# Altium schematic sheet Sheet1.SchDoc: Controle de Motor
size A4; Organization: Altium Limited; Address1: L3, 12a Rodborough Rd; Address2: Frenchs Forest; Address3: NSW; Address4: Australia 2086; DocumentNumber: 001; Revision: 0; SheetNumber: 1; SheetTotal: 2
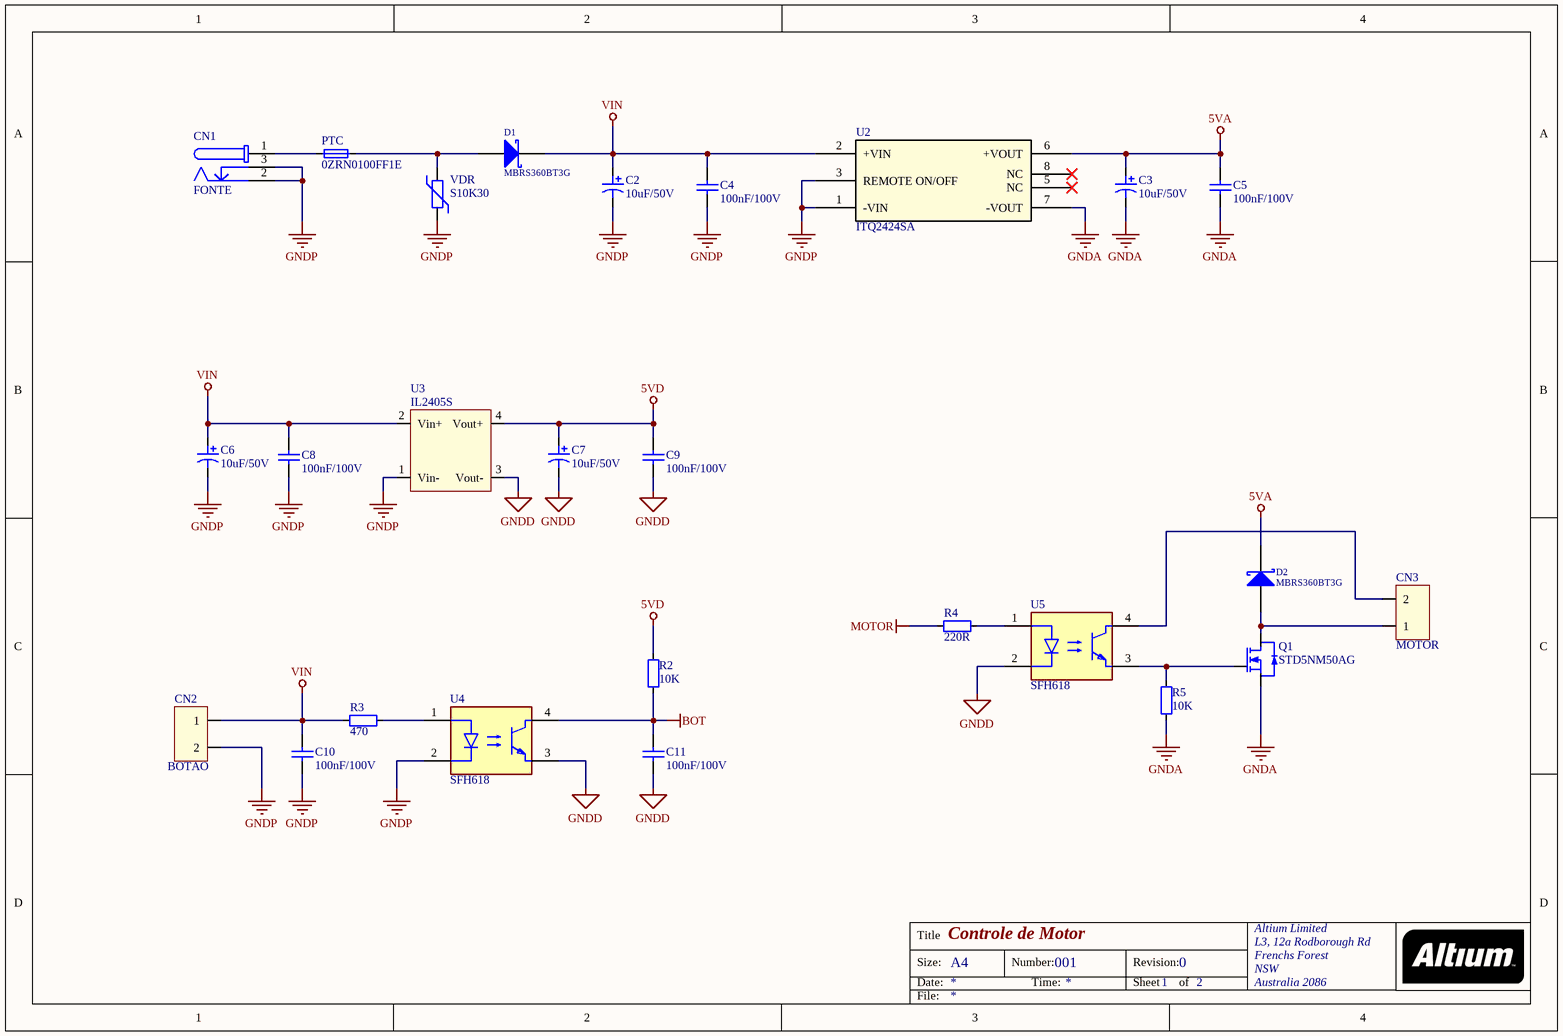
[diagram p0: Sheet1.SchDoc]

## Parts
C2  10uF/50V  [CapE SMD D6.3 L5.8]
C3  10uF/50V  [CapE SMD D6.3 L5.8]
C4  100nF/100V  [0603C-GENERIC]
C5  100nF/100V  [0603C-GENERIC]
C6  10uF/50V  [CapE SMD D6.3 L5.8]
C7  10uF/50V  [CapE SMD D6.3 L5.8]
C8  100nF/100V  [0603C-GENERIC]
C9  100nF/100V  [0603C-GENERIC]
C10  100nF/100V  [0603C-GENERIC]
C11  100nF/100V  [0603C-GENERIC]
CN1  FONTE  [Power Jack 694106301002]
CN2  BORNE  [AKZ700/2]  (value not drawn)
CN3  BORNE  [AKZ700/2]  (value not drawn)
D1  MBRS360BT3G  [DO-214AA(SMB)]
D2  MBRS360BT3G  [DO-214AA(SMB)]
PTC  0ZRN0100FF1E  [PTC LVR]
Q1  STD5NM50AG  [DPAK-3_ONS]
R2  10K  [0603R]
R3  470  [Res 1206]
R4  220R  [0603R]
R5  10K  [0603R]
U2  ITQ2424SA  [SIP8_ITQ2424_XPR]
U3  IL2405S  [IL SERIES]
U4  SFH618  [FP-83911-MFG]
U5  SFH618  [FP-83911-MFG]
VDR  S10K30  [VDR D12H14.5-7.5]

## Nets
5VA: C3.1(+) C5.2 D2.2(K) U2.6(+VOUT)
5VD: C7.1(+) C9.2 R2.1 U3.4(Vout+)
BOT: C11.2 R2.2 U4.4(C)
GNDA: C3.2(-) C5.1 Q1.2(S) R5.2 U2.7(-VOUT)
GNDD: C7.2(-) C9.1 C11.1 U3.3(Vout-) U4.3(E) U5.2(C)
GNDP: C2.2(-) C4.1 C6.2(-) C8.1 C10.1 CN1.2 CN1.3 CN2.2 U2.1(-VIN) U2.3(REMOTE_ON/OFF) U3.1(Vin-) U4.2(C) VDR.1
MOTOR: R4.1
VIN: C2.1(+) C4.2 C6.1(+) C8.2 C10.2 CN2.1 D1.2(K) R3.2 U2.2(+VIN) U3.2(Vin+)
NetCN1_1: CN1.1 PTC.1
NetCN3_1: CN3.1 D2.1(A) Q1.3(D)
NetCN3_2: CN3.2 U5.4(C)
NetD1_1: D1.1(A) PTC.2 VDR.2
NetQ1_1: Q1.1(G) R5.1 U5.3(E)
NetR3_1: R3.1 U4.1(A)
NetR4_2: R4.2 U5.1(A)

Not connected (* = marked no-connect by the designer): U2 5(NC)* 8(NC)*

## Notes on the sheet
- (near CN3) MOTOR
- (near CN2) BOTAO
- Title
- Size:
- Date:
- A4
- Number:
- Time:
- Revision:
- Sheet
- of
- File:

## Library data of the parts
C2 C3 C6 C7 = Cap Eletrolitico: Capacitor Eletrolítico Radial SMD; Protheus: E3CS3010U0003
C4 C5 C8-C11 = Cap Ceramico SMD: Capacitor Cerâmico SMD; Protheus: E3CSC100N0002
CN1 = DC Power Jack: Part Number: 694106301002; NexarPartId: 52676100; Voltage Rating: 24V; Insulation Resistance: 100MΩ; Current Rating: 5A; Shielding: Unshielded; Number of Contacts: 3; Mouser: 710-694106301002; Housing Material: Polyamide; Contact Gender: Female; Connector Type: Power; REACH SVHC: Unknown; Termination: Through Hole; Height: 11mm; RoHS: Compliant; Mount: Through Hole; Flammability Rating: UL94 V-0; Packaging: Bulk; Min Operating Temperature: -40°C; Contact Plating: Tin; Max Operating Temperature: 85°C; Operating Supply Voltage: 24V; Contact Material: Gold, Tin
CN2 CN3 = 1x2 Pinos: 2 pinos
D1 D2 = BAT54: Schottky Barrier Diode; Manufacturer 1: Fairchild Semiconductor; Protheus: E2DIOD0000018; Montar: Sim; Supplier Part Number 1: BAT54FSCT-ND; Manufacturer Part Number 1: BAT54
PTC = LVR008N: Fusível Thermistor PTC; Protheus: E2DIVE0000059
Q1 = BSS138: Transistor N-Channel; Protheus: E2TRAN0000008
R2 R5 = E3RSM010K0001: Resistor Metal Filme; Protheus: E3RSM010K0002; Value: 10K
R3 = E3RSM010K0001: Resistor Metal Filme; Protheus: E3RSM430R0001
R4 = E3RSM010K0001: Resistor Metal Filme; Protheus: E3RSM010K0002; Value: 10K
U2 = ITQ2424SA: No Description Available; Manufacturer_Name: XP Power; Copyright: Copyright (C) 2026 Ultra Librarian. All rights reserved.; Manufacturer_Part_Number: ITQ2424SA; RefDes: RefDes; Type: Type
U3 = IL2405S: Conversor DC/DC 2W; Part Number: E2CONV0000006
U4 U5 = CMP-00026-00002-1: Optocoupler Dc-in 1-CH Transistor Dc-out 4-PIN PDIP SMD T/r; Protheus: E2UACO0000007
VDR = VDR 1000L160: Varistor 30VAC/48VDC; Protheus: E2VARI0000001